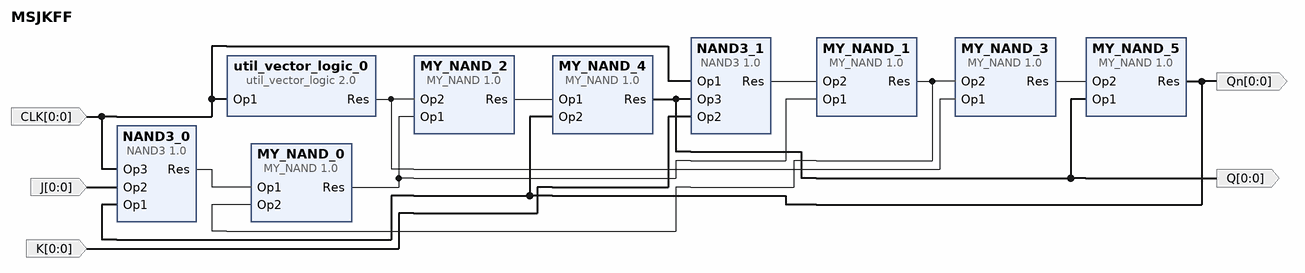
[diagram p0: block diagram of the top level]
# Vivado block design MSJKFF, xc7vx485tffg1157-1, Vivado 2019.1
create_bd_design MSJKFF

create_bd_port -dir I -from 0 -to 0 CLK
create_bd_port -dir I -from 0 -to 0 J
create_bd_port -dir I -from 0 -to 0 K
create_bd_port -dir O -from 0 -to 0 Q
create_bd_port -dir O -from 0 -to 0 Qn

create_bd_cell -type ip -vlnv xilinx.com:ip:util_vector_logic:2.0 util_vector_logic_0
set_property -dict {CONFIG.C_OPERATION not CONFIG.C_SIZE 1} [get_bd_cells util_vector_logic_0]
create_bd_cell -type ip -vlnv Group5:user:NAND3:1.0 NAND3_0
create_bd_cell -type ip -vlnv Group5:user:NAND3:1.0 NAND3_1
create_bd_cell -type ip -vlnv Group5:user:MY_NAND:1.0 MY_NAND_0
create_bd_cell -type ip -vlnv Group5:user:MY_NAND:1.0 MY_NAND_1
create_bd_cell -type ip -vlnv Group5:user:MY_NAND:1.0 MY_NAND_2
create_bd_cell -type ip -vlnv Group5:user:MY_NAND:1.0 MY_NAND_3
create_bd_cell -type ip -vlnv Group5:user:MY_NAND:1.0 MY_NAND_4
create_bd_cell -type ip -vlnv Group5:user:MY_NAND:1.0 MY_NAND_5

# ---- connections ----

connect_bd_net [get_bd_ports CLK] [get_bd_pins util_vector_logic_0/Op1] [get_bd_pins NAND3_0/Op3] [get_bd_pins NAND3_1/Op1]
connect_bd_net [get_bd_ports J] [get_bd_pins NAND3_0/Op2]
connect_bd_net [get_bd_ports K] [get_bd_pins NAND3_1/Op2]
connect_bd_net [get_bd_pins NAND3_0/Res] [get_bd_pins MY_NAND_0/Op1]
connect_bd_net [get_bd_pins NAND3_1/Res] [get_bd_pins MY_NAND_1/Op2]
connect_bd_net [get_bd_pins util_vector_logic_0/Res] [get_bd_pins MY_NAND_3/Op1] [get_bd_pins MY_NAND_2/Op2]
connect_bd_net [get_bd_pins MY_NAND_1/Res] [get_bd_pins MY_NAND_3/Op2] [get_bd_pins MY_NAND_0/Op2]
connect_bd_net [get_bd_pins MY_NAND_0/Res] [get_bd_pins MY_NAND_2/Op1] [get_bd_pins MY_NAND_1/Op1]
connect_bd_net [get_bd_pins MY_NAND_2/Res] [get_bd_pins MY_NAND_4/Op1]
connect_bd_net [get_bd_pins MY_NAND_3/Res] [get_bd_pins MY_NAND_5/Op2]
connect_bd_net [get_bd_pins MY_NAND_5/Res] [get_bd_pins MY_NAND_4/Op2] [get_bd_ports Qn] [get_bd_pins NAND3_0/Op1]
connect_bd_net [get_bd_pins MY_NAND_4/Res] [get_bd_pins MY_NAND_5/Op1] [get_bd_ports Q] [get_bd_pins NAND3_1/Op3]

validate_bd_design
save_bd_design
